# EAGLE design door_opener (EAGLE 7.2.0)
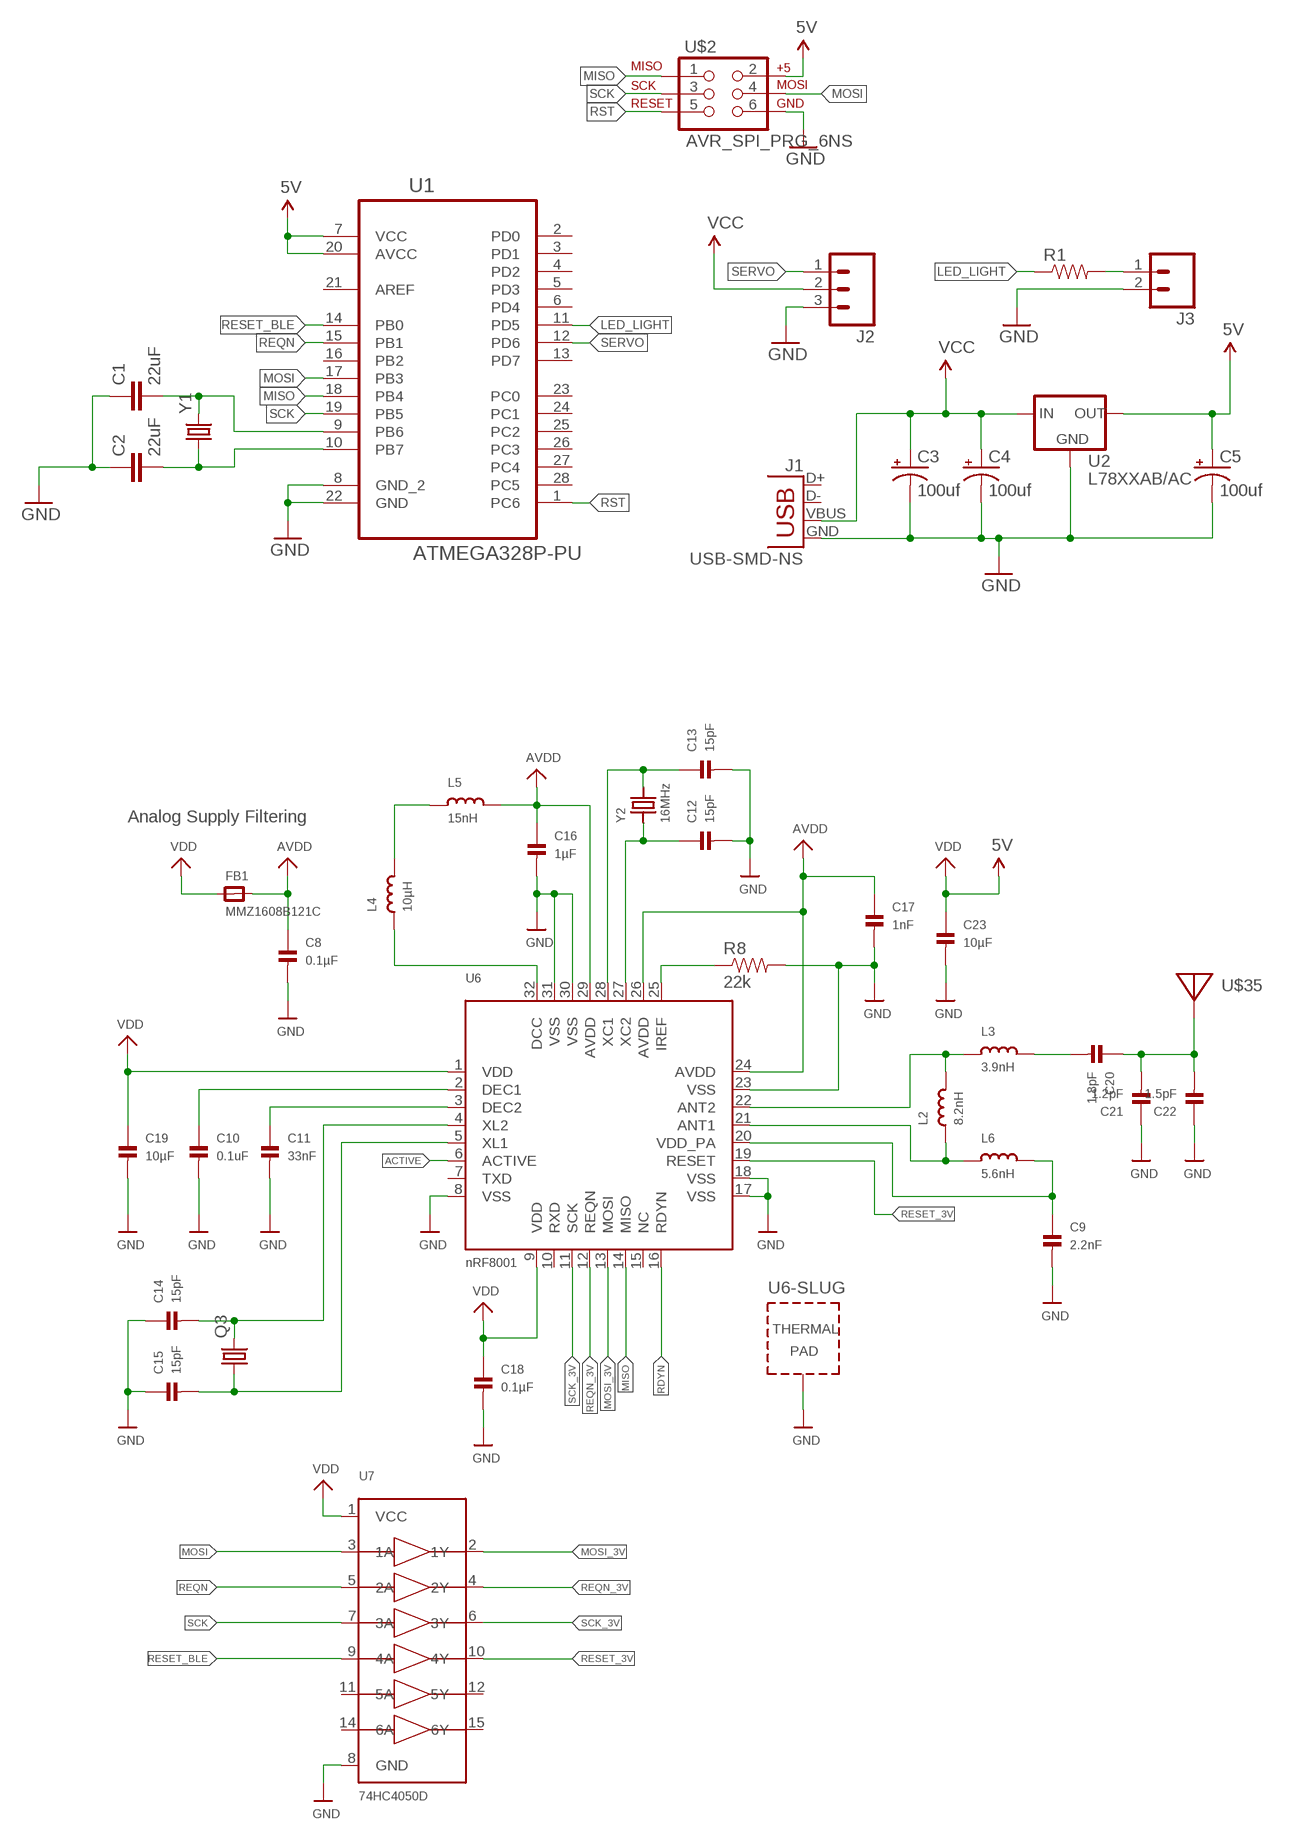
[diagram p0: schematic, sheet 1]

## Parts
C1  22uF  22UF-16V-20%-(1210)  [1210]
C2  22uF  22UF-16V-20%-(1210)  [1210]
C3  100uf  CAP_POLF80  [NIPPON_F80]
C4  100uf  CAP_POLF80  [NIPPON_F80]
C5  100uf  CAP_POLF80  [NIPPON_F80]
C8  0.1µF  CAP_CERAMIC0402  [0402]
C9  2.2nF  CAP_CERAMIC_0402  [_0402]
C10  0.1uF  CAP_CERAMIC0402  [0402]
C11  33nF  CAP_CERAMIC0402  [0402]
C12  15pF  CAP_CERAMIC0402  [0402]
C13  15pF  CAP_CERAMIC0402  [0402]
C14  15pF  CAP_CERAMIC0402  [0402]
C15  15pF  CAP_CERAMIC0402  [0402]
C16  1µF  CAP_CERAMIC0402  [0402]
C17  1nF  CAP_CERAMIC_0603  [_0603]
C18  0.1µF  CAP_CERAMIC0402  [0402]
C19  10µF  CAP_CERAMIC0402  [0402]
C20  1.8pF  CAP_CERAMIC_0402MP  [_0402MP]
C21  1.2pF  CAP_CERAMIC_0402MP  [_0402MP]
C22  1.5pF  CAP_CERAMIC_0402MP  [_0402MP]
C23  10µF  CAP_CERAMIC0402  [0402]
FB1  MMZ1608B121C  FERRITE0805  [0805]
J1  USB-SMD-NS  [USB-MINIB-NOSTOP]
J2  M031X03_NO_SILK  [1X03_NO_SILK]
J3  M021X02_NO_SILK  [1X02_NO_SILK]
L2  8.2nH  INDUCTOR_0402  [_0402]
L3  3.9nH  INDUCTOR_0402  [_0402]
L4  10µH  INDUCTOR_0603  [_0603]
L5  15nH  INDUCTOR_0603  [_0603]
L6  5.6nH  INDUCTOR_0402  [_0402]
Q3  CRYSTAL5X3  [CRYSTAL-SMD-5X3]
R1  RESISTOR1206  [1206]
R8  22k  RESISTOR  [0805]
U1  ATMEGA328P-PU  [DIP254P762X457-28]
U2  L78XXAB/AC  [78XXL]
U6  nRF8001  NRF8001  [QFN32_5MM]
U7  74HC4050D  74HC4050DTSSOP  [TSSOP16]
U$2  AVR_SPI_PRG_6NS  [2X3-NS]
U$35  ANTENNA_PCBNRF8001_1.6MM  [ANT_PCB_2.4GHZ_NRF8001_1.6MM_1OZ]
Y1  CRYSTALHC49US  [HC49US]
Y2  16MHz  CRYSTAL3.2X2.5  [CRYSTAL_3.2X2.5]

## Nets
5V: C5.+ C23.1 U1.7(VCC) U1.20(AVCC) U2.OUT U$2.2 ; supply symbol labelled VDD
+3.3V: C18.1 C19.1 FB1.1 U6.1(VDD) U6.9(VDD) U7.1(VCC) ; supply symbol labelled VDD
ACTIVE: U6.6(ACTIVE)
AVDD: C8.1 C16.1 C17.1 FB1.2 L5.2 U6.24(AVDD) U6.26(AVDD) U6.29(AVDD)
GND: C1.1 C2.1 C3.- C4.- C5.- C8.2 C9.2 C10.2 C11.2 C12.2 C13.2 C14.1 C15.1 C16.2 C17.2 C18.2 C19.2 C21.1 C22.1 C23.2 J1.GND J2.3 J3.2 R8.2 U1.8(GND_2) U1.22(GND) U2.GND U6.8(VSS) U6.17(VSS) U6.18(VSS) U6.23(VSS) U6.30(VSS) U6.31(VSS) U6.33(TP) U7.8(GND) U$2.6
LED_LIGHT: R1.1 U1.11(PD5)
MISO: U1.18(PB4) U6.14(MISO) U$2.1
MOSI: U1.17(PB3) U7.3(1A) U$2.4
MOSI_3V: U6.13(MOSI) U7.2(1Y)
N$1: C1.2 U1.9(PB6) Y1.2
N$2: C2.2 U1.10(PB7) Y1.1
N$3: J3.1 R1.2
N$7: C9.1 L6.2 U6.20(VDD_PA)
N$8: C11.1 U6.3(DEC2)
N$13: C10.1 U6.2(DEC1)
N$14: C13.1 U6.28(XC1) Y2.2
N$15: C12.1 U6.27(XC2) Y2.1
N$17: L4.1 U6.32(DCC)
N$18: R8.1 U6.25(IREF)
N$19: L4.2 L5.1
N$20: L2.2 L3.1 U6.22(ANT2)
N$21: L2.1 L6.1 U6.21(ANT1)
N$22: C14.2 Q3.3 U6.4(XL2)
N$23: C15.2 Q3.1 U6.5(XL1)
N$24: C20.2 L3.2
N$25: C20.1 C21.2 C22.2 U$35.FEED
RDYN: U6.16(RDYN)
REQN: U1.15(PB1) U7.5(2A)
REQN_3V: U6.12(REQN) U7.4(2Y)
RESET_3V: U6.19(RESET) U7.10(4Y)
RESET_BLE: U1.14(PB0) U7.9(4A)
RST: U1.1(PC6) U$2.5
SCK: U1.19(PB5) U7.7(3A) U$2.3
SCK_3V: U6.11(SCK) U7.6(3Y)
SERVO: J2.1 U1.12(PD6)
VCC: C3.+ C4.+ J1.VBUS J2.2 U2.IN
Unconnected: J1.D+ J1.D- U1.2(PD0) U1.3(PD1) U1.4(PD2) U1.5(PD3) U1.6(PD4) U1.13(PD7) U1.16(PB2) U1.21(AREF) U1.23(PC0) U1.24(PC1) U1.25(PC2) U1.26(PC3) U1.27(PC4) U1.28(PC5) U6.7(TXD) U6.10(RXD) U6.15(NC) U7.11(5A) U7.12(5Y) U7.14(6A) U7.15(6Y)

## Notes on the sheet
- Analog Supply Filtering

## Library data of the parts
C1 C2 = SparkFun-Capacitors:22UF-16V-20%-(1210): CAP-10381; PROD_ID: CAP-10381
C3-C5 = SparkFun-Capacitors:CAP_POL: Capacitor Polarized These are standard SMD and PTH capacitors. Normally 10uF, 47uF, and 100uF in electrolytic and tantalum varieties. Always verify the external diameter of the through hole cap, it varies with capacity, voltage, and manufacturer. The EIA devices should be standard.
C8-C23 = microbuilder:CAP_CERAMIC: Ceramic Capacitors 0402 - 0402 Surface Mount Capacitors 16pF 50V 5% [Digikey: 445-4899-2-ND] 18pF 50V 5% [Digikey: 490-1281-2-ND] 22pF 50V 5% [Digikey: 490-1283-2-ND] 68pF 50V 5% [Digikey: 490-1289-2-ND] 0.1uF 10V 10% [Digikey: 490-1318-2-ND] 1.0uF 6.3V 10% [Digikey: 490-1320-2-ND] 0603 - 0603 Surface Mount Capacitors 16 pF 50V 5% [Digikey: 445-5051-2-ND] 22 pF 50V [Digikey: PCC220ACVTR-ND] 33 pF 50V 5% [Digikey: 490-1415-1-ND] 56pF 50V 5% [Digikey: 490-1421-1-ND] 220pF 50V 5% [Digikey: 445-1285-1-ND] 680 pF 50V 2200 pF 50V 5% C0G [Digikey: 445-1297-1-ND] 5600 pF 100V 5% X7R [Digikey: 478-3711-1-ND] 0.1 µF 25V 10% [Digikey: PCC2277TR-ND] 0.22 µF 16V 10% X7R [Digikey: 445-1318-1-ND] 1.0 µF 25V 10% [Digikey: 445-5146-2-ND] 0603 - RF Specific 3pF 250V +/-0.1pF RF [Digikey: 712-1347-1-ND] 18 pF 250V 5% [Digikey: 478-3505-1-ND or 712-1322-1-ND] 56 pF 250V 5% C0G RF [Digikey: 490-4867-1-ND] 68 pF 250V RF [Digikey: 490-4868-1-ND] 0805 - 0805 Surface Mount Capacitors 220 pF 250V 2% RF Ceramic Capacitor [Digikey: 712-1398-1-ND] 1000 pF 50V 2% NP0 Ceramic Capacitor [Digikey: 478-3760-1-ND] 0.1 µF 25V 10% Ceramic Capacitor [Digikey: PCC1828TR-ND] 1.0 µF 16V 10% Ceramic Capacitor[Digikey: 490-1691-2-ND] 10.0 µF 10V 10% Ceramic Capacitor[Digikey: 709-1228-1-ND] 10.0 uF 16V 10% Ceramic Capacitor [Digikey: 478-5165-2-ND] 47 uF 6.3V 20% Ceramic Capacitor [Digikey: 587-1779-1-ND or 399-5506-1-ND] 1206 - 1206 Surface Mount Capacitors 47uF 10V 20% Ceramic Capacitor [Digikey: 490-5528-1-ND or 399-5508-1-ND or 445-6010-1-ND] 100uF 6.3V -20%, +80% Y5V Ceramic Capacitor (Digikey: 490-4512-1-ND, Mouser: 81-GRM31CF50J107ZE1L)
FB1 = microbuilder:FERRITE: Ferrite Bead 0603 MMZ1608B121C - 120 Ohm @ 100MHz, 600mA, 0.15 Ohm DC Resistance - Digikey: 445-2164-1-ND BK1608HW121-T - 120 Ohm, 600mA Ferrite Chip - Digikey: 587-1876-2-ND 0805 HZ0805B272R-10 - 2.7K Ohm @ 100MHz, 200mA, 0.8 Ohm DC Resistance - Digikey: 240-2504-1-ND (see also Murata BLM21BD272SN1L) MMZ2012Y152B - 1.5K Ohm @ 100MHz, 500mA, 0.4 Ohm DC Resistance - Digikey: 445-1560-1-ND - Mainly for high frequency (80-400MHz) MMZ2012R102A - 1K Ohm @ 100MHz, 500mA, 0.3 Ohm DC Resistance - Digikey: 445-1555-2-ND - More general purpose (10-200MHz)
J1 = SparkFun-Connectors:USB: USB Connectors USB-B-PTH is fully proven SKU : PRT-00139/CONN-08278 USB-miniB is fully proven SKU : PRT-00587 USB-A-PCB is untested. USB-A-H is throughly reviewed, but untested. Spark Fun Electronics SKU : PRT-00437 USB-B-SMT is throughly reviewed, but untested. Needs silkscreen touching up. USB-A-S has not been used/tested USB-MB-H has not been used/tested USB-MICROB has been used. CONN-09505
J2 = SparkFun-Connectors:M03: Header 3 Standard 3-pin 0.1" header. Use with straight break away headers (SKU : PRT-00116), right angle break away headers (PRT-00553), swiss pins (PRT-00743), machine pins (PRT-00117), and female headers (PRT-00115). Molex polarized connector foot print use with SKU : PRT-08232 with associated crimp pins and housings.
J3 = SparkFun-Connectors:M02: Standard 2-pin 0.1" header. Use with - straight break away headers ( PRT-00116) - right angle break away headers (PRT-00553) - swiss pins (PRT-00743) - machine pins (PRT-00117) - female headers (PRT-00115) Molex polarized connector foot print use with: PRT-08233 with associated crimp pins and housings. 2.54_SCREWTERM for use with PRT-10571. 3.5mm Screw Terminal footprints for PRT-08084 5mm Screw Terminal footprints for use with PRT-08432
L2-L6 = microbuilder:INDUCTOR: Inductors 0603: 10nH Ceramic Inductor - microwire antenna/RF (Digikey: 712-1434-2-ND) 0805: 560nH Ceramic Inductor - RF (Digikey: 553-1047-1-ND) 270nH Ceramic Inductor - Q = 40@250MHz, +-5%, 1 Ohm DC Resistance (Digikey: 535-10506-2-ND) 1007 (2518 Metric) SMT: 10µH 10% 250mOhm 820mA 1007 Inductor (Digikey: 587-2189-1-ND) 22µH 10% 500mOhm 580mA 1007 Inductor (Digikey: 587-2190-1-ND) 47µH 10% 950mOhm 420mA 1007 Inductor (Digikey: 587-2191-1-ND) 47µH 5% 100mOhm 1A 1008 Inductor (Digikey: 732-1816-1-ND) 5.0x5.0mm (Taiyo Yuden NR5040 Series) 6.8µH 20% 2.3A 64mOhm Inductor (Digikey: 587-2374-2-ND) 5.0x5.0mm (TDK VLC5045 Series) 4.7µH 20% 3.3A 34mOhm Inductor (Digikey: 445-6526-1-ND) 6.8µH 20% 2.7A 46mOhm Inductor (Digikey: 445-6527-1-ND) 6.0x6.0mm (TDK VLC6045 Series) 4.7µH 20% 3.8A 27mOhm Inductor (Digikey: 445-6538-2-ND) 6.8µH 20% 3A 41mOhm Inductor (Digikey: 445-6540-1-ND) 6.2µH 30% 2.2A 45mOhm Inductor (Digikey: SRR5028-6R2YCT-ND) - Not TDK VLC6045 but footprint should match 6.0x6.0mm (TDK SLF6045 Series) 6.8uH 30% 2A 33mOhm Inductor (Digikey: 445-4572-1-ND, Mouser: 810-SLF645T6R8N2R0PF)
Q3 = SparkFun:CRYSTAL: Crystals
R1 = SparkFun-Passives:RESISTOR: Resistor
R8 = SparkFun:RESISTOR: Resistor
U1 = Atmel_By_element14_Batch_1-00:ATMEGA328P-PU: 8-bit Microcontroller with In-System Programmable Flash; MPN: ATMEGA328P-PU; OC_FARNELL: 1715487; OC_NEWARK: 15R0268; PACKAGE: PDIP-28; SUPPLIER: Atmel
U2 = v-reg:L78XX: VOLTAGE REGULATOR
U6 = microbuilder:NRF8001: nRF8001 - Bluetooth Low-Energy Transceiver VDD: 1.9-3.6V Temp: -40°C - 85°C
U7 = microbuilder:74HC4050D: 6-channel level shifter 74HC4050D - 2V-6V Supply SOIC16 Digikey: 74HC4050D,653-ND Mouser: 771-74HC4050D-T TSSOP16 Digikey: 296-9215-1-ND Mouser:
U$2 = SparkFun:AVR_SPI_PRG_6: AVR ISP 6 Pin This is the reduced ISP connector for AVR programming. Common on Arduino. This footprint will take up less PCB space and can be used with a 10-pin to 6-pin adapter such as SKU: BOB-08508
U$35 = microbuilder:ANTENNA_PCB: Various pre-calculated PCB Antennas NRF8001 1.6mm 1Oz - 2.4GHz PCB antenna for 1.6mm PCBs with 1oz copper, double-sided boards (no GND plan beneath antenna). See nRF2740 production files for further information and impedance matching network. 868MHz/2.4GHz DUALBAND - Dual 868MHz and 2.4GHz centered antenna based on board #6 of the CC-ANTENNA-DK from Chipcon/TI
Y1 = SparkFun-FreqCtrl:CRYSTAL: Various standard crystals. Proven footprints.
Y2 = microbuilder:CRYSTAL: Crystals

## Board
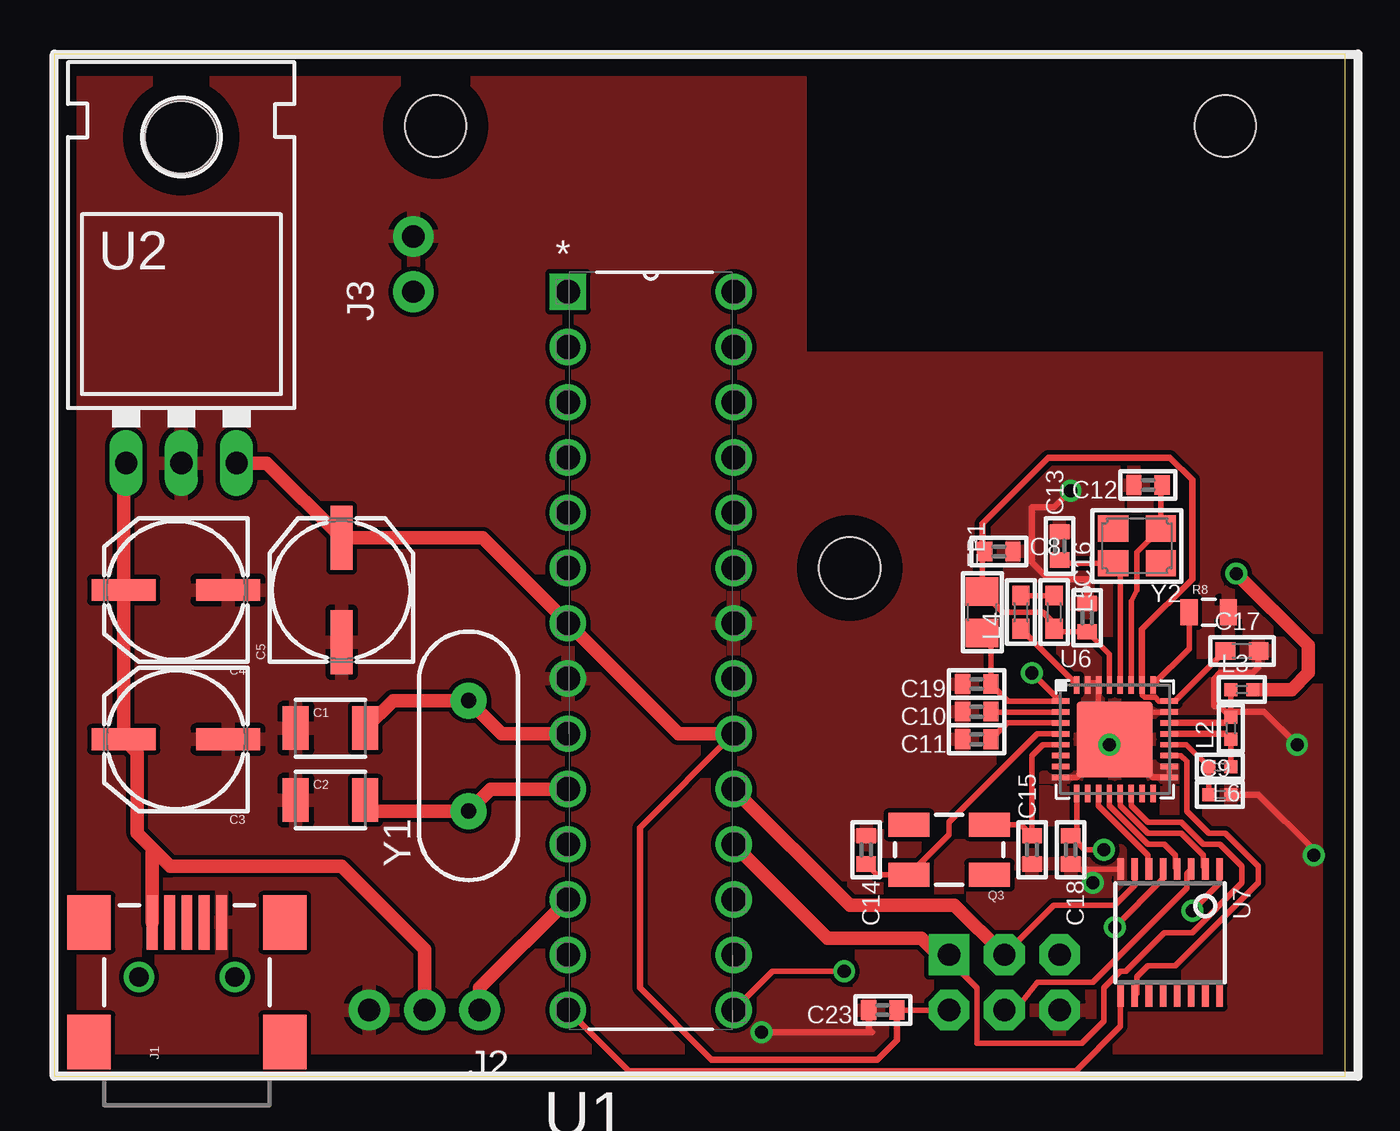
[diagram p1: board, top side]
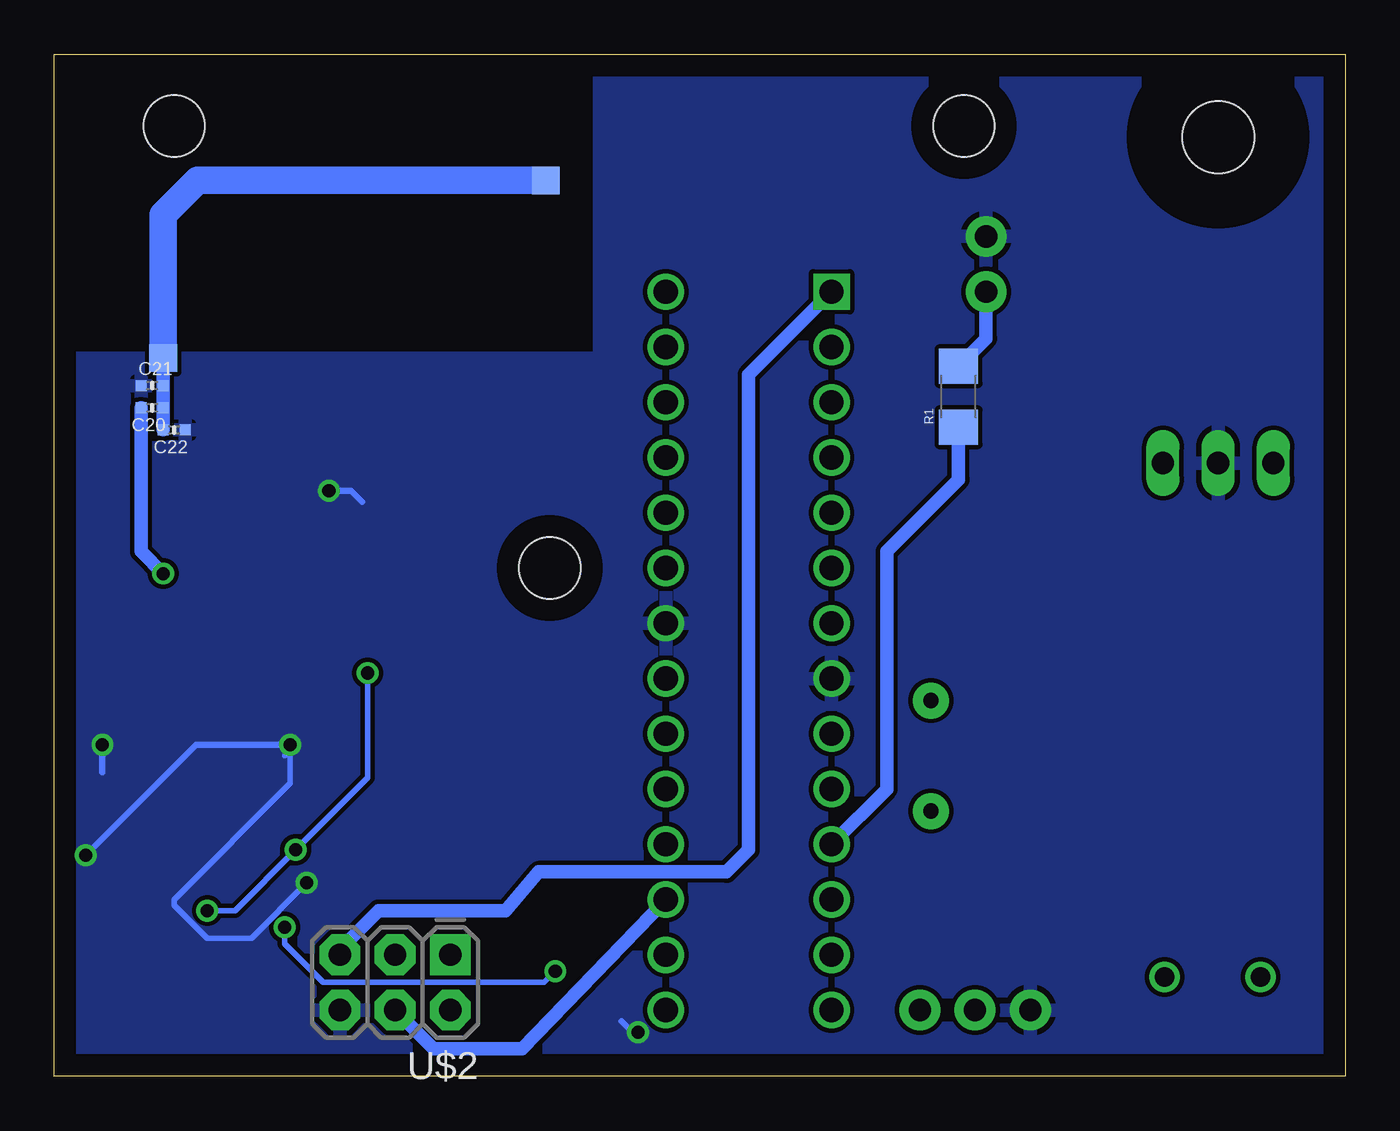
[diagram p2: board, bottom side, seen from below]

Size 59.36 x 46.98 mm. Coordinates in mm from the lower left corner, seen from the top.
Outline: 0,0 59.36,0 59.36,46.98 0,46.98 0,0
Copper layers (1*16): Top 0.035mm / dielectric 1.5mm / Bottom 0.035mm
Design rules "default": minimum track width 10mil, minimum drill 24mil, track to track 8mil, track to pad 8mil, pad to pad 8mil, via to via 8mil, smd to smd 8mil, copper to edge 40mil, drill to drill 8mil, minimum pad ring 10mil, minimum via ring 8mil, stop-mask expansion 4mil, vias tented up to drill 0mil, thermal gap 10mil
Holes 2.8 mm at 53.85,43.69 17.53,43.69 36.58,23.37

### Footprints (pad centres in the part's own frame; a part is rotated, then mirrored left to right if it is on the bottom)
1210 = smd 1.2 x 2: 1 -1.6,0; 2 1.6,0
NIPPON_F80 = smd 2.95 x 1: + 2.4,0; - -2.4,0
0402 = smd 0.7 x 0.9: 1 -0.65,0; 2 0.65,0
_0402 = smd 0.6 x 0.6: 1 -0.508,0; 2 0.508,0
_0603 = smd 0.9 x 0.8: 1 -0.762,0; 2 0.762,0
_0402MP = smd 0.5 x 0.5: 1 -0.508,0; 2 0.508,0
0805 = smd 1.3 x 1.5: 1 -0.95,0; 2 0.95,0
USB-MINIB-NOSTOP = smd 2.5 x 0.5: D+ 2.5,0; D- 2.5,0.8; GND 2.5,-1.6; ID 2.5,-0.8; VBUS 2.5,1.6 | smd 2.5 x 2: G1 -3,-4.5; G2 -3,4.5; G3 2.5,4.5; G4 2.5,-4.5 | drill 0.9 pad 0.8: H1 0,2.2 | drill 0.9 pad 0.787: H2 0,-2.2
1X03_NO_SILK = drill 1.016 pad 1.88: 1 0,0; 2 2.54,0; 3 5.08,0
1X02_NO_SILK = drill 1.016 pad 1.88: 1 0,0; 2 2.54,0
CRYSTAL-SMD-5X3 = smd 1.9 x 1.1: 1 -1.85,-1.15; 2 1.85,-1.15; 3 1.85,1.15; 4 -1.85,1.15
1206 = smd 1.6 x 1.8: 1 -1.4,0; 2 1.4,0
0805' = smd 0.8 x 1.2: 1 -0.9,0; 2 0.9,0
DIP254P762X457-28 = drill 1.118 square: 1 -7.62,33.02 | drill 1.118: 2 -7.62,30.48; 3 -7.62,27.94; 4 -7.62,25.4; 5 -7.62,22.86; 6 -7.62,20.32; 7 -7.62,17.78; 8 -7.62,15.24; 9 -7.62,12.7; 10 -7.62,10.16; 11 -7.62,7.62; 12 -7.62,5.08; 13 -7.62,2.54; 14 -7.62,0; 15 0,0; 16 0,2.54; 17 0,5.08; 18 0,7.62; 19 0,10.16; 20 0,12.7; 21 0,15.24; 22 0,17.78; 23 0,20.32; 24 0,22.86; 25 0,25.4; 26 0,27.94; 27 0,30.48; 28 0,33.02
78XXL = drill 1.016 long: GND 0,-3.81; IN -2.54,-3.81; OUT 2.54,-3.81 | hole 3.302: 0,11.176
QFN32_5MM = smd 0.8 x 0.25: 1 -2.5,1.75; 2 -2.5,1.25; 3 -2.5,0.75; 4 -2.5,0.25; 5 -2.5,-0.25; 6 -2.5,-0.75; 7 -2.5,-1.25; 8 -2.5,-1.75; 17 2.5,-1.75; 18 2.5,-1.25; 19 2.5,-0.75; 20 2.5,-0.25; 21 2.5,0.25; 22 2.5,0.75; 23 2.5,1.25; 24 2.5,1.75 | smd 0.25 x 0.8: 9 -1.75,-2.5; 10 -1.25,-2.5; 11 -0.75,-2.5; 12 -0.25,-2.5; 13 0.25,-2.5; 14 0.75,-2.5; 15 1.25,-2.5; 16 1.75,-2.5; 25 1.75,2.5; 26 1.25,2.5; 27 0.75,2.5; 28 0.25,2.5; 29 -0.25,2.5; 30 -0.75,2.5; 31 -1.25,2.5; 32 -1.75,2.5 | smd 3.5 x 3.5: 33 0,0
TSSOP16 = smd 0.305 x 0.991: 1 -2.275,-2.918; 2 -1.625,-2.918; 3 -0.975,-2.918; 4 -0.325,-2.918; 5 0.325,-2.918; 6 0.975,-2.918; 7 1.625,-2.918; 8 2.275,-2.918; 9 2.275,2.918; 10 1.625,2.918; 11 0.975,2.918; 12 0.325,2.918; 13 -0.325,2.918; 14 -0.975,2.918; 15 -1.625,2.918; 16 -2.275,2.918
2X3-NS = drill 1.016 pad 1.88 square: 1 -2.54,-1.27 | drill 1.016 pad 1.88 octagon: 2 -2.54,1.27; 3 0,-1.27; 4 0,1.27; 5 2.54,-1.27; 6 2.54,1.27
ANT_PCB_2.4GHZ_NRF8001_1.6MM_1OZ = smd 1.27 x 1.27: FEED 0,0; TESTPOINT -8.169,17.605
HC49US = drill 0.7 pad 1.651: 1 -2.54,0; 2 2.54,0
CRYSTAL_3.2X2.5 = smd 1.4 x 1.2: 1 -1.1,-0.8; 2 1.1,0.8; GND1 -1.1,0.8; GND2 1.1,-0.8

### Placement (x,y rotation side)
C1  12.7,16 0 top
C2  12.7,12.7 0 top
C3  5.59,15.49 180 top
C4  5.59,22.35 180 top
C5  13.21,22.35 90 top
C8  43.43,24.13 0 top
C9  53.59,12.95 0 top
C10  42.42,16.76 180 top
C11  42.42,15.49 180 top
C12  50.29,27.18 180 top
C13  46.23,24.38 90 top
C14  37.34,10.41 270 top
C15  44.96,10.41 90 top
C16  47.5,21.08 90 top
C17  54.61,19.56 0 top
C18  46.74,10.41 270 top
C19  42.42,18.03 180 top
C20  54.86,30.73 180 bottom
C21  54.86,31.75 0 bottom
C22  53.85,29.72 180 bottom
C23  38.1,3.05 180 top
FB1  42.67,21.34 90 top
J1  6.1,4.57 90 top
J2  19.56,3.05 180 top
J3  16.51,36.07 90 top
L2  54.1,16 90 top
L3  54.61,17.78 0 top
L4  44.45,21.34 90 top
L5  45.97,21.34 270 top
L6  53.59,14.22 180 top
Q3  41.15,10.41 180 top
R1  17.78,31.24 90 bottom
R8  22k  [0805']  53.09,21.34 0 top
U1  31.24,3.05 0 top
U2  5.84,32 0 top
U6  48.77,15.49 0 top
U7  51.31,6.6 180 top
U$2  43.69,4.32 180 bottom
U$35  54.36,33.02 270 bottom
Y1  19.05,14.73 90 top
Y2  49.78,24.38 180 top

### Tracks (layer width: path | path; a pad name or v marks a point on that pad's centre or on a via)
5V
  Top 0.254: U$2.2 C23.1
  Top 0.305: U1.20 26.92,11.43 26.92,4.06 30.23,0.76 37.85,0.76 38.75,1.67 C23.1
  Top 0.61: U2.OUT 9.77,28.19 C5.+ 19.7,24.75 U1.7 28.7,15.75 U1.20
+3.3V  (via drill 0.6 pad 0.25)
  Top 0.254: U6.9 47.02,11.35 C18.1 47.39,10.41 v48.26,10.41 | FB1.1 43.07,19.99 C19.1 43.86,17.24 U6.1 46.26,17.24 v44.96,18.54 | U7.1 53.58,8.88 v52.32,7.62
  Bottom 0.254: v52.32,7.62 51.05,7.62 v48.26,10.41 44.96,13.72 v44.96,18.54
AVDD
  Top 0.254: U6.29 48.52,19.41 C16.1 46.12,20.43 L5.2 45.97,20.83 45.47,21.34 43.62,21.34 FB1.2 42.67,24.02 C8.1 | C17.1 51.53,17.24 U6.24 50.8,17.24 50.62,17.42 50.14,17.42 50.04,17.53 50.04,17.97 U6.26
  Top 0.305: U6.26 50.02,20.55 52.32,22.86 52.32,27.43 51.31,28.45 45.72,28.45 42.67,25.4 42.67,24.24 C8.1
GND  (via drill 0.6 pad 0.25)
  Top 0.254: U6.23 50.02,16.74 U6.33 | U6.33 48.02,16.24 U6.30 47.94,18.1 47.62,18.1 U6.31 | v48.51,15.24 U6.33 | 50.04,14.22 U6.33 | U7.8 47.24,9.52 | 47.24,9.52 46.98,9.52 C18.2 | v48.51,15.24 47.02,13.74 U6.8 46.26,13.74 46.23,13.72 46.99,13.72 v48.51,15.24 | v47.75,8.89 47.75,9.01 47.24,9.52 | U6.18 51.28,14.13 51.28,13.81 U6.17
  Top 0.305: U6.17 50.52,13.74 50.04,14.22 49.53,14.22 v48.51,15.24 | v57.91,10.16 57.91,10.41 55.37,12.95 C9.2 | C17.2 55.37,18.8 55.12,18.54 53.59,18.54 53.34,18.29 53.34,17.02 53.59,17.02 53.85,16.76 55.63,16.76 v57.15,15.24 | C23.2 37.45,2.17 37.59,2.03 v32.51,2.03 | C16.2 47.5,22.86 45.72,22.86 44.96,23.62 44.96,26.16 45.97,26.16 v46.74,26.92
  Bottom 0.254: 48.77,14.73 48.51,14.99 v48.51,15.24 48.51,13.46 53.85,8.13 53.85,7.87 52.32,6.35 50.29,6.35 v47.75,8.89
  Bottom 0.305: v48.51,15.24 52.83,15.24 v57.91,10.16 | v32.51,2.03 32.77,2.03 33.27,2.54 | v46.74,26.92 45.72,26.92 45.21,26.42 | v57.15,15.24 57.15,13.97
  pour Bottom: 0,0 0,46.99 34.29,46.99 34.29,33.02 59.69,33.02 59.69,0
  pour Top: 0,0 0,46.99 34.29,46.99 34.29,33.02 59.69,33.02 59.69,0
LED_LIGHT
  Bottom 0.61: U1.11 21.08,13.21 21.08,24.13 17.78,27.43 R1.1
MISO
  Top 0.254: U$2.1 41.15,5.33 42.42,4.06 42.42,1.52 47.24,1.52 48.26,2.54 48.26,4.06 49.02,4.83 49.28,4.83 51.05,6.6 52.32,6.6 54.61,8.89 54.61,9.65 53.59,10.67 52.83,10.67 51.82,11.68 50.29,11.68 49.53,12.45 U6.14
  Top 0.61: U1.18 35.56,6.35 39.88,6.35 40.64,5.59 U$2.1
MOSI
  Top 0.254: U$2.4 44.2,3.05 45.21,4.32 47.75,4.32 52.07,8.64 52.07,9.31 U7.3
  Bottom 0.61: U1.17 37.85,1.27 41.91,1.27 U$2.4
MOSI_3V
  Top 0.254: U6.13 49.02,12.45 50.29,11.18 51.82,11.18 52.83,10.16 52.83,9.62 U7.2
N$1
  Top 0.61: C1.2 15.57,17.27 Y1.2 20.57,15.75 U1.9
N$2
  Top 0.61: C2.2 14.81,12.19 Y1.1 20.07,13.21 U1.10
N$3
  Bottom 0.61: R1.2 16.51,33.91 J3.1
N$7
  Top 0.254: U6.20 52.07,15.24 L6.2 C9.1
N$8
  Top 0.254: C11.1 43.82,16.24 U6.3
N$13
  Top 0.254: C10.1 43.09,16.74 U6.2
N$14
  Top 0.254: U6.28 49.02,23.25 Y2.2 46.38,23.58 C13.1
N$15
  Top 0.254: U6.27 49.52,21.83 49.78,22.35 49.78,24.08 Y2.1 50.88,27.12 C12.1
N$17
  Top 0.254: L4.1 47.02,18.01 U6.32
N$18
  Top 0.254: U6.25 52.19,19.66 R8.1
N$19
  Top 0.254: L4.2 L5.1
N$20
  Top 0.254: L2.2 L3.1
  Top 0.305: L2.2 53.84,16.24 U6.22
N$21
  Top 0.254: L2.1 L6.1
  Top 0.305: L2.1 53.85,15.74 U6.21
N$22
  Top 0.254: U6.4 45.21,15.74 41.15,11.68 41.15,11.11 Q3.3 37.84,9.26 C14.2
N$23
  Top 0.254: Q3.1 44.46,11.56 C15.2 44.96,14.73 45.47,15.24 U6.5
N$24  (via drill 0.6 pad 0.25)
  Top 0.61: L3.2 56.9,17.78 57.66,18.54 57.66,19.81 v54.36,23.11
  Bottom 0.61: v54.36,23.11 55.37,24.13 C20.2
N$25
  Bottom 0.61: C22.2 C20.1 C21.2 U$35.FEED
REQN  (via drill 0.6 pad 0.25)
  Top 0.254: U7.5 50.98,9.07 v48.77,6.86 | v36.32,4.83 33.02,4.83 U1.15
  Bottom 0.254: v48.77,6.86 48.77,6.1 46.99,4.32 36.83,4.32 v36.32,4.83
REQN_3V
  Top 0.254: U6.12 48.52,12.44 50.29,10.67 51.05,10.67 51.56,10.16 51.56,9.59 U7.4
RESET_3V
  Top 0.254: U6.19 51.8,14.74 52.07,14.48 52.07,12.19 53.09,11.18 53.85,11.18 55.37,9.65 55.37,8.89 51.56,5.08 50.29,5.08 49.78,4.57 49.78,3.79 U7.10
RESET_BLE
  Top 0.254: U7.9 49.03,2.3 46.99,0.25 26.42,0.25 U1.14
RST
  Bottom 0.61: U1.1 27.43,32.26 27.43,10.41 28.45,9.4 37.08,9.4 38.61,7.62 44.45,7.62 46.23,5.84 U$2.5
SCK
  Top 0.254: U7.7 49.68,8.79 48.77,7.87 45.97,7.87 U$2.3
  Top 0.61: U1.19 36.58,7.87 41.4,7.87 U$2.3
SCK_3V
  Top 0.254: U6.11 48.02,12.43 50.29,10.16 50.29,9.56 U7.6
SERVO
  Top 0.61: J2.1 19.56,4.06 U1.12
VCC
  Top 0.61: J2.2 17.02,5.84 13.21,9.65 5.33,9.65 4.5,10.49 | 4.5,10.49 3.81,11.18 3.81,14.87 C3.+ C4.+ 3.19,28.08 U2.IN | J1.VBUS 4.5,10.49